# EAGLE schematic m-analog-v0.1 (EAGLE 7.2.0)
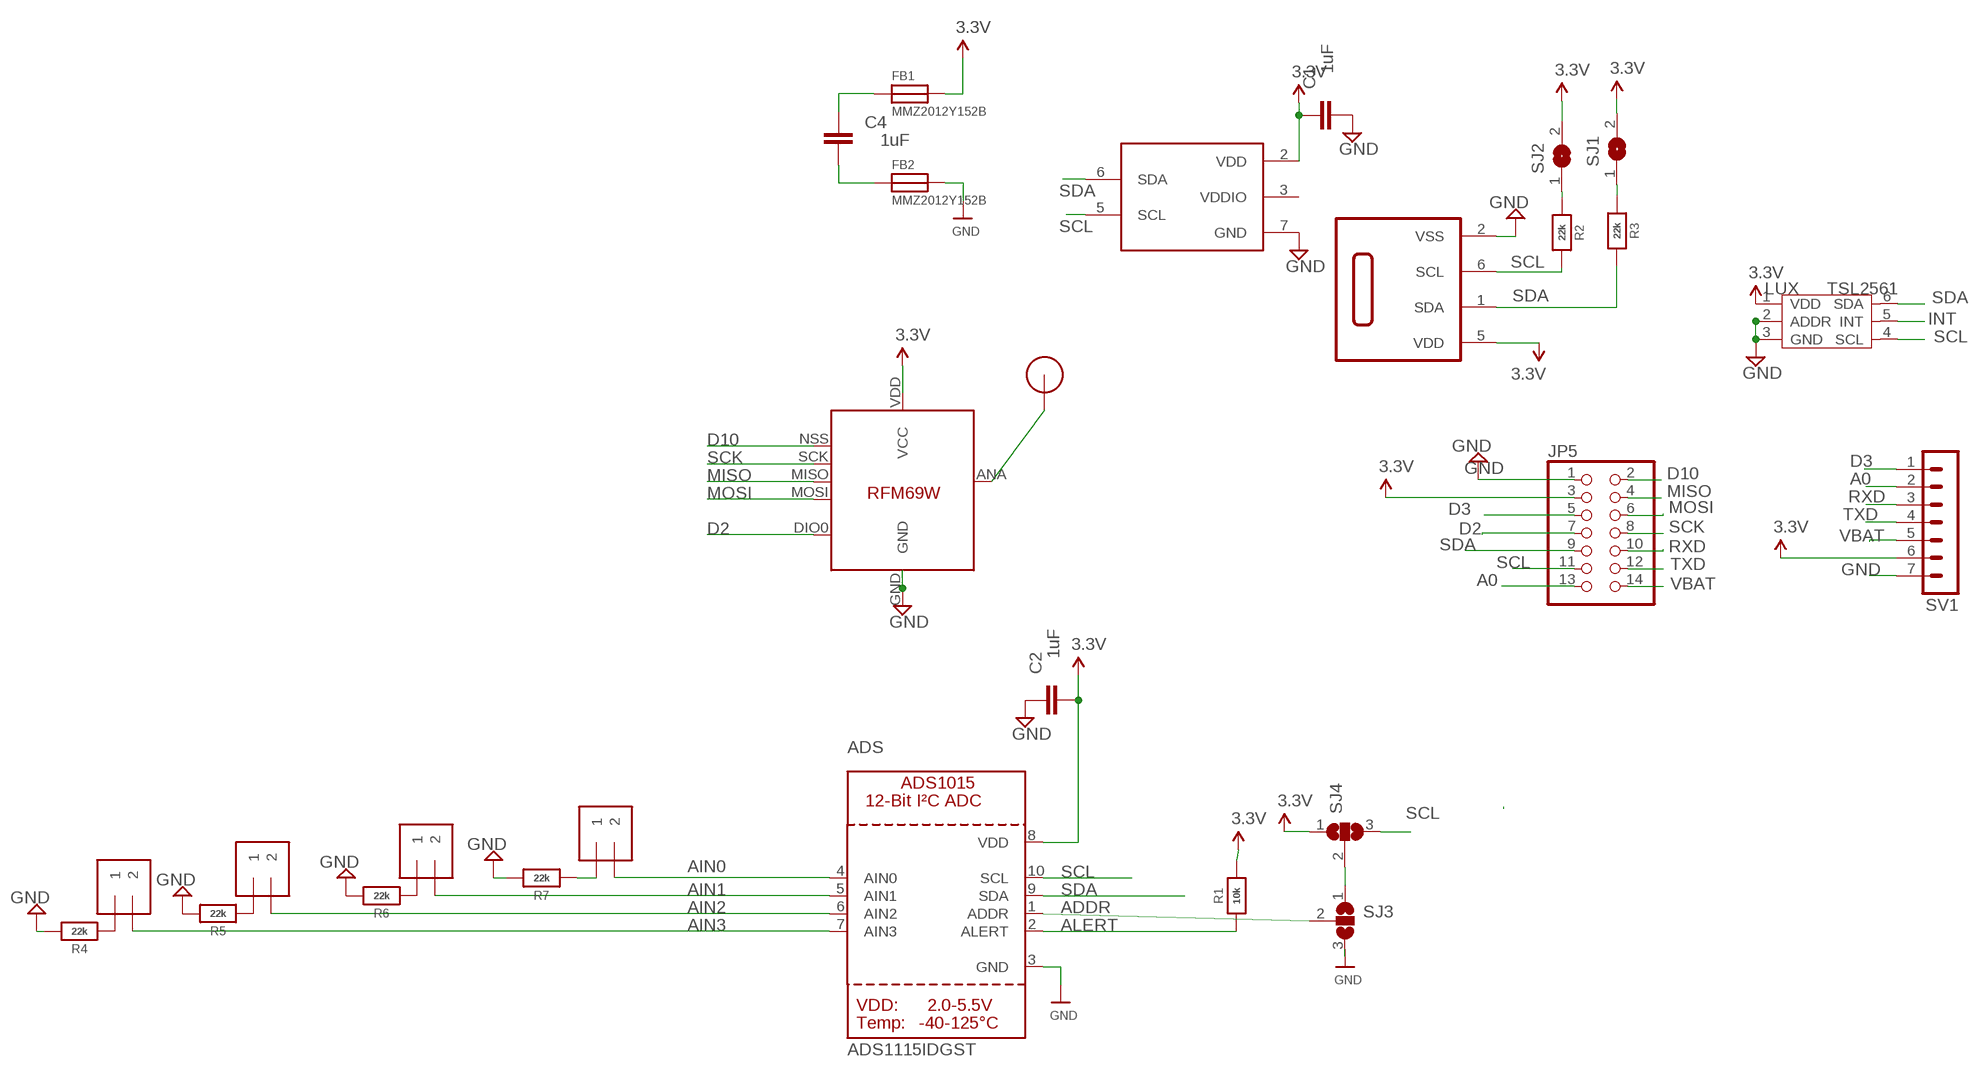
[diagram p0: schematic, sheet 1]

## Parts
ADS  ADS1115IDGST  ADC_ADS1015  [MSOP10]
C1  1uF  CAP0603-CAP  [0603-CAP]
C2  1uF  CAP0603-CAP  [0603-CAP]
C4  1uF  CAP0603-CAP  [0603-CAP]
FB1  MMZ2012Y152B  FERRITE0805  [0805]
FB2  MMZ2012Y152B  FERRITE0805  [0805]
IN0  1X2-3.5MM  [1X2-3.5MM]
IN1  1X2-3.5MM  [1X2-3.5MM]
IN2  1X2-3.5MM  [1X2-3.5MM]
IN3  1X2-3.5MM  [1X2-3.5MM]
JP5  PINHD-2X7  [2X07]
LUX  TSL2561  TSL2561T  [TMB-6]
R1  10k  RESISTOR_0603_NOOUT  [0603-NO]
R2  22k  RESISTOR_0603_NOOUT  [0603-NO]
R3  22k  RESISTOR_0603_NOOUT  [0603-NO]
R4  22k  RESISTOR_0603_NOOUT  [0603-NO]
R5  22k  RESISTOR_0603_NOOUT  [0603-NO]
R6  22k  RESISTOR_0603_NOOUT  [0603-NO]
R7  22k  RESISTOR_0603_NOOUT  [0603-NO]
SJ1  SJ  [SJ]
SJ2  SJ  [SJ]
SJ3  SJ2W  [SJ_2]
SJ4  SJ2W  [SJ_2]
SN1  SHT21  [DFN6/SHT]
SV1  MA07-1  [MA07-1]
U1  BMP180  [BMP180]
U$1  RFM12B_ANTENNA  [RFM12B-ANTENNA]
U$5  RFM69  [RFM69W-MINPADS]

## Nets
A0: JP5.13 SV1.2
ADDR: ADS.1(ADDR) SJ3.2
AIN0: ADS.4(AIN0) IN0.2
AIN1: ADS.5(AIN1) IN1.2
AIN2: ADS.6(AIN2) IN2.2
AIN3: ADS.7(AIN3) IN3.2
ALERT: ADS.2(ALERT) R1.1
D2: JP5.7 U$5.DIO0
D3: JP5.5 SV1.1
D10: JP5.2 U$5.NSS(SEL)
GND: ADS.3(GND) C1.1 C2.2 FB2.2 JP5.1 LUX.2(ADDR) LUX.3(GND) R4.2 R5.2 R6.2 R7.2 SJ3.3 SN1.2(VSS) SV1.7 U1.7(GND) U$5.GND
INT: LUX.5(INT)
MISO: JP5.4 U$5.MISO
MOSI: JP5.6 U$5.MOSI
N$1: C4.2 FB1.1
N$2: C4.1 FB2.1
N$3: SJ3.1 SJ4.2
N$5: R3.1 SJ1.1
N$6: R2.1 SJ2.1
N$7: IN3.1 R4.1
N$8: IN2.1 R5.1
N$9: IN1.1 R6.1
N$10: IN0.1 R7.1
N$23: U$1.P$1 U$5.ANA(ANT)
RXD: JP5.10 SV1.3
SCK: JP5.8 U$5.SCK
SCL: ADS.10(SCL) JP5.11 LUX.4(SCL) R2.2 SJ4.3 SN1.6(SCL) U1.5(SCL)
SDA: ADS.9(SDA) JP5.9 LUX.6(SDA) R3.2 SN1.1(SDA) U1.6(SDA)
TXD: JP5.12 SV1.4
VBAT [vcc]: JP5.14 SV1.5
VCC: ADS.8(VDD) C1.2 C2.1 FB1.2 JP5.3 LUX.1(VDD) R1.2 SJ1.2 SJ2.2 SJ4.1 SN1.5(VDD) SV1.6 U1.2(VDD) U$5.VDD(VCC) ; supply symbol labelled 3.3V

## Power pins joined to a net without a drawn wire
VDDIO: U1.3(VDDIO)

## Library data of the parts
ADS = microbuilder:ADC_ADS1015: ADS1015 - 12-bit 4-Channel I2C ADC with Internal PGA VDD: 2.0-5.5V Sampling Rate: 3.3ksps Gain Settings: 2/3, 1, 2, 4, 8, 16 I2C Address: ADDR low = 1001000x, ADDR high = 1001001x Internal Comparator The ADS1015 includes an internal comparator that can be set to output a high-level on ALERT when the conversion results exceeeds a pre-defined upper level, and will deassert itself when the level falls below a pre-defined lower threshold level. It can also be set to windowed mode where the ALERT pin will be asserted if the data exceeds the upper threshold or falls below the lower threshold.
C1 C2 C4 = SparkFun:CAP: Capacitor Standard 0603 ceramic capacitor, and 0.1" leaded capacitor.
FB1 FB2 = microbuilder:FERRITE: Ferrite Bead 0603 MMZ1608B121C - 120 Ohm, 600mA Ferrite Chip - Digikey: 445-2164-1-ND BK1608HW121-T - 120 Ohm, 600mA Ferrite Chip - Digikey: 587-1876-2-ND 0805 HZ0805B272R-10 - 2.7K Ohm @ 100MHz, 200mA 0.8 Ohm DC Resistance - Digikey: 240-2504-1-ND (see also Murata BLM21BD272SN1L)
IN0 IN1-IN3 = adafruit:1X2: 3.5mm Terminal block http://www.ladyada.net/library/pcb/eaglelibrary.html
JP5 = pinhead:PINHD-2X7: PIN HEADER
LUX = template:TSL2561: Light-TO-Digital Converter
R1-R7 = microbuilder:RESISTOR: Resistors For new designs, use the packages preceded by an '_' character since they are more reliable: The following footprints should be used on most boards: _0402 - Standard footprint for regular board layouts _0603 - Standard footprint for regular board layouts _0805 - Standard footprint for regular board layouts _1206 - Standard footprint for regular board layouts For extremely tight-pitch boards where space is at a premium, the following 'micro-pitch' footprints can be used (smaller pads, no silkscreen outline, etc.): _0402MP - Micro-pitch footprint for very dense/compact boards _0603MP - Micro-pitch footprint for very dense/compact boards _0805MP - Micro-pitch footprint for very dense/compact boards _1206MP - Micro-pitch footprint for very dense/compact boards
SJ1 SJ2 = jumper:SJ: SMD solder JUMPER
SJ3 SJ4 = jumper:SJ2W: SMD solder JUMPER
SN1 = SHT21:SHT21
SV1 = con-lstb:MA07-1: PIN HEADER; OC_FARNELL: unknown; OC_NEWARK: unknown
U1 = BMP180:BMP180
U$1 = LowPowerLab:RFM12B_ANTENNA
U$5 = LowPowerLab:RFM69